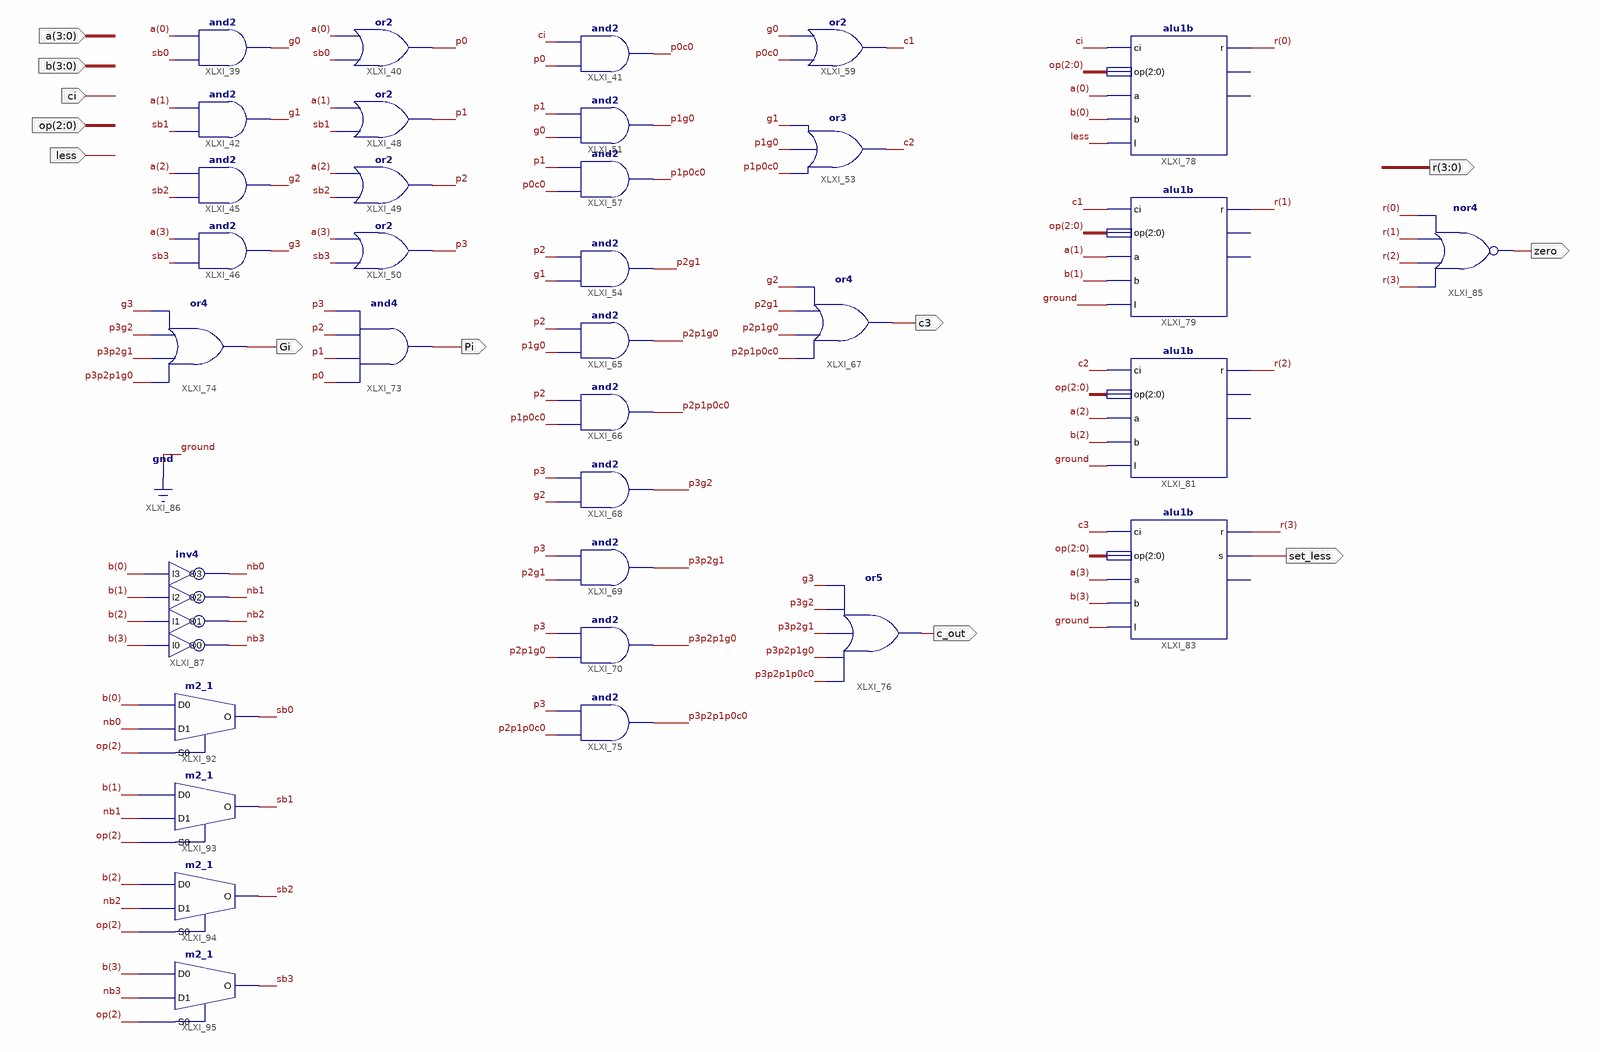
[diagram p0: schematic sheet 1]
// Xilinx ISE schematic claAdder4b.sch (spartan3e) as structural Verilog: 34 symbols, 12 ports
module claAdder4b (
  input  [3:0] a,
  input  [3:0] b,
  input  ci,
  input  [2:0] op,
  input  less,
  output c3,
  output Pi,
  output Gi,
  output [3:0] r,
  output c_out,
  output zero,
  output set_less
);

  wire c1, c2, g0, g1, g2, g3, nb0, nb1, nb2, nb3, p0, p0c0, p1, p1g0, p1p0c0, p2, p2g1, p2p1g0, p2p1p0c0,
       p3, p3g2, p3p2g1, p3p2p1g0, p3p2p1p0c0, sb0, sb1, sb2, sb3;

  and XLXI_39 (g0, sb0, a[0]);
  and XLXI_42 (g1, sb1, a[1]);
  and XLXI_41 (p0c0, p0, ci);
  or XLXI_40 (p0, sb0, a[0]);
  and XLXI_45 (g2, sb2, a[2]);
  and XLXI_46 (g3, sb3, a[3]);
  or XLXI_48 (p1, sb1, a[1]);
  or XLXI_49 (p2, sb2, a[2]);
  or XLXI_50 (p3, sb3, a[3]);
  and XLXI_51 (p1g0, g0, p1);
  and XLXI_54 (p2g1, g1, p2);
  and XLXI_57 (p1p0c0, p0c0, p1);
  or XLXI_53 (c2, p1p0c0, p1g0, g1);
  or XLXI_59 (c1, p0c0, g0);
  and XLXI_65 (p2p1g0, p1g0, p2);
  and XLXI_66 (p2p1p0c0, p1p0c0, p2);
  or XLXI_67 (c3, p2p1p0c0, p2p1g0, p2g1, g2);
  and XLXI_68 (p3g2, g2, p3);
  and XLXI_69 (p3p2g1, p2g1, p3);
  and XLXI_70 (p3p2p1g0, p2p1g0, p3);
  and XLXI_73 (Pi, p0, p1, p2, p3);
  or XLXI_74 (Gi, p3p2p1g0, p3p2g1, p3g2, g3);
  and XLXI_75 (p3p2p1p0c0, p2p1p0c0, p3);
  or XLXI_76 (c_out, p3p2p1p0c0, p3p2p1g0, p3p2g1, p3g2, g3);
  alu1b XLXI_78 (.a(a[0]), .b(b[0]), .ci(ci), .l(less), .op(op), .r(r[0]));  // open: co, s
  alu1b XLXI_79 (.a(a[1]), .b(b[1]), .ci(c1), .l(1'b0), .op(op), .r(r[1]));  // open: co, s
  alu1b XLXI_81 (.a(a[2]), .b(b[2]), .ci(c2), .l(1'b0), .op(op), .r(r[2]));  // open: co, s
  alu1b XLXI_83 (.a(a[3]), .b(b[3]), .ci(c3), .l(1'b0), .op(op), .r(r[3]), .s(set_less));  // open: co
  nor XLXI_85 (zero, r[3], r[2], r[1], r[0]);
  inv4 XLXI_87 (.I0(b[3]), .I1(b[2]), .I2(b[1]), .I3(b[0]), .O0(nb3), .O1(nb2), .O2(nb1), .O3(nb0));
  m2_1 XLXI_92 (.D0(b[0]), .D1(nb0), .S0(op[2]), .O(sb0));
  m2_1 XLXI_93 (.D0(b[1]), .D1(nb1), .S0(op[2]), .O(sb1));
  m2_1 XLXI_94 (.D0(b[2]), .D1(nb2), .S0(op[2]), .O(sb2));
  m2_1 XLXI_95 (.D0(b[3]), .D1(nb3), .S0(op[2]), .O(sb3));
endmodule
